# EAGLE design j0y-modul (EAGLE 5.10)
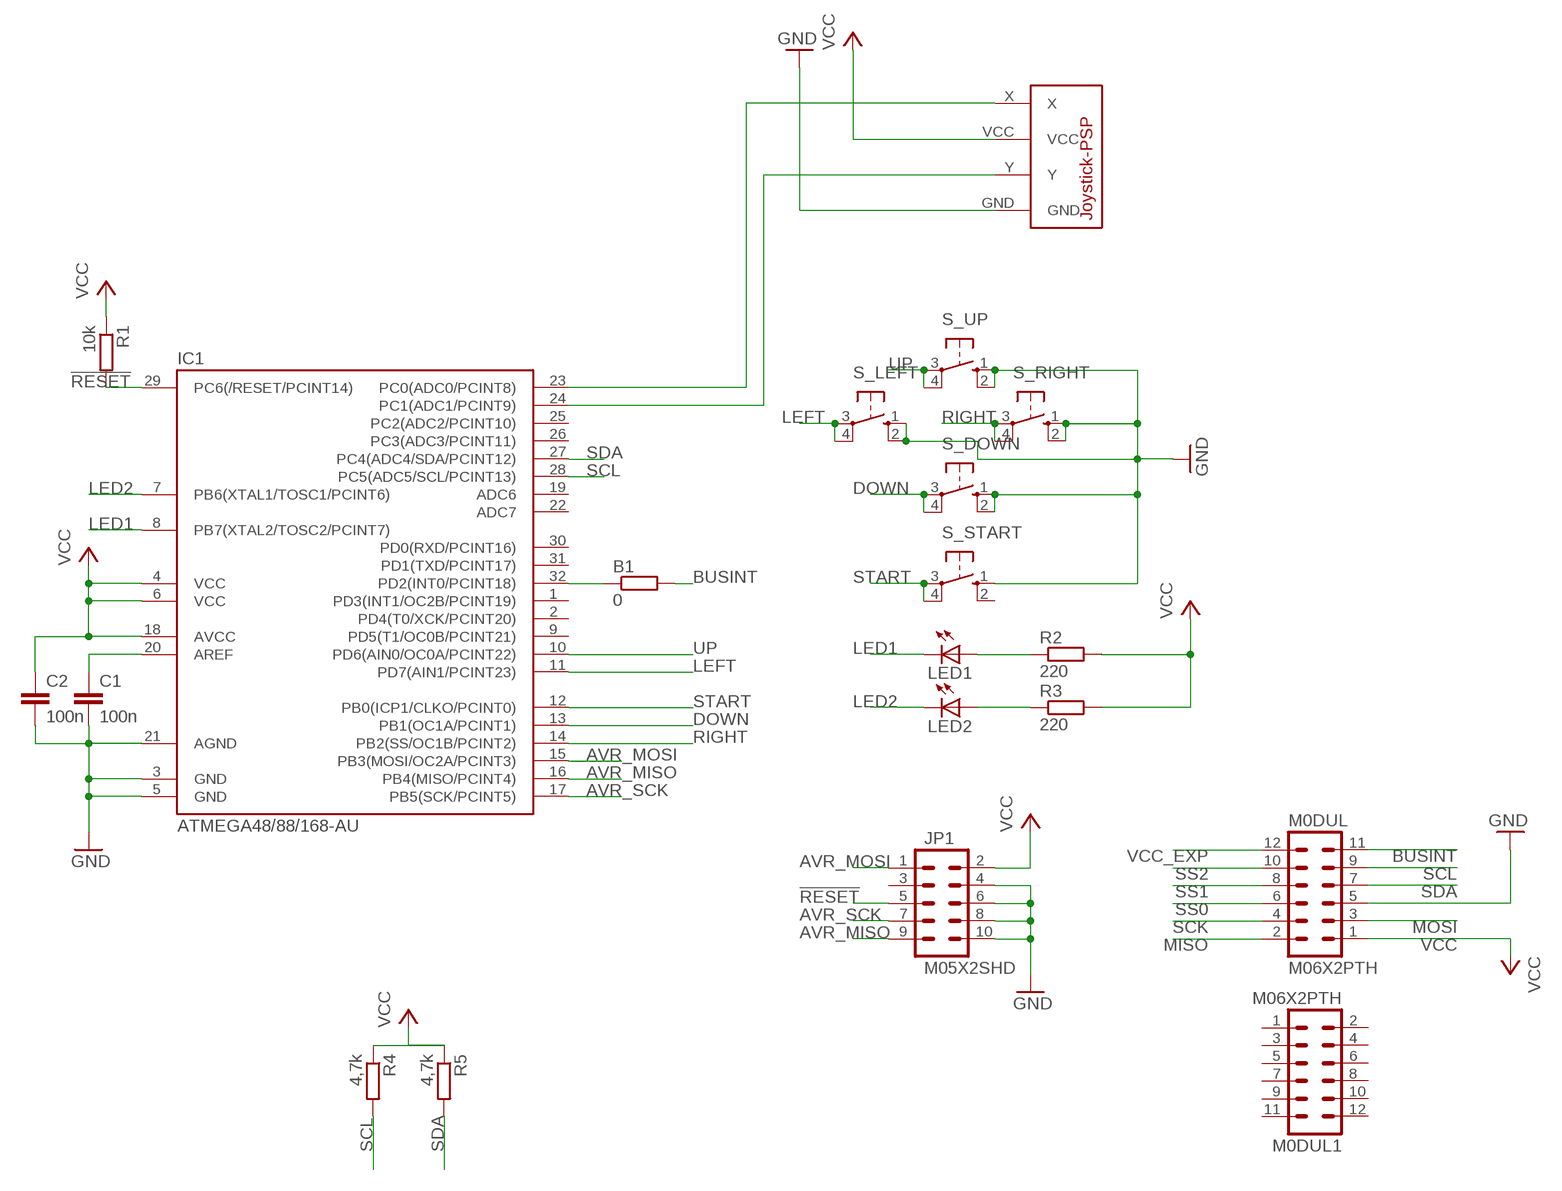
[diagram p0: schematic, sheet 1]

## Parts
B1  0  R-EU_R0805  [R0805]
C1  100n  C-EUC0805  [C0805]
C2  100n  C-EUC0805  [C0805]
IC1  ATMEGA48/88/168-AU  [TQFP32-08]
JP1  M05X2SHD  [2X5-SHROUDED]
LED1  LED3MM  [LED3MM]
LED2  LED3MM  [LED3MM]
M0DUL  M06X2PTH  MA06-2  [MA06-2]
M0DUL1  M06X2PTH  MA06-2  [MA06-2]
R1  10k  R-EU_R0805  [R0805]
R2  220  R-EU_R0805  [R0805]
R3  220  R-EU_R0805  [R0805]
R4  4,7k  R-EU_R0805  [R0805]
R5  4,7k  R-EU_R0805  [R0805]
S_DOWN  10-XX  [B3F-10XX]
S_LEFT  10-XX  [B3F-10XX]
S_RIGHT  10-XX  [B3F-10XX]
S_START  10-XX  [B3F-10XX]
S_UP  10-XX  [B3F-10XX]
U$1  JOYSTICK-PSP1000  [JOYSTICK-PSP1000]

## Nets
!RESET: IC1.29(PC6(/RESET/PCINT14)) JP1.5 R1.2
AVR_MISO: IC1.16(PB4(MISO/PCINT4)) JP1.9
AVR_MOSI: IC1.15(PB3(MOSI/OC2A/PCINT3)) JP1.1
AVR_SCK: IC1.17(PB5(SCK/PCINT5)) JP1.7
BUSINT: B1.2 M0DUL.11
DOWN: IC1.13(PB1(OC1A/PCINT1)) S_DOWN.3(P) S_DOWN.4(P1)
GND: C1.2 C2.2 IC1.3(GND) IC1.5(GND) IC1.21(AGND) JP1.4 JP1.6 JP1.8 JP1.10 M0DUL.5 S_DOWN.1(S) S_DOWN.2(S1) S_LEFT.1(S) S_LEFT.2(S1) S_RIGHT.1(S) S_RIGHT.2(S1) S_START.1(S) S_UP.1(S) S_UP.2(S1) U$1.GND
LED1: IC1.8(PB7(XTAL2/TOSC2/PCINT7)) LED1.K(C)
LED2: IC1.7(PB6(XTAL1/TOSC1/PCINT6)) LED2.K(C)
LEFT: IC1.11(PD7(AIN1/PCINT23)) S_LEFT.3(P) S_LEFT.4(P1)
MISO: M0DUL.2
MOSI: M0DUL.3
N$1: IC1.24(PC1(ADC1/PCINT9)) U$1.Y
N$2: IC1.23(PC0(ADC0/PCINT8)) U$1.X
N$3: C1.1 IC1.20(AREF)
N$4: B1.1 IC1.32(PD2(INT0/PCINT18))
N$6: LED2.A R3.1
N$7: LED1.A R2.1
RIGHT: IC1.14(PB2(SS/OC1B/PCINT2)) S_RIGHT.3(P) S_RIGHT.4(P1)
SCK: M0DUL.4
SCL: IC1.28(PC5(ADC5/SCL/PCINT13)) M0DUL.9 R4.2
SDA: IC1.27(PC4(ADC4/SDA/PCINT12)) M0DUL.7 R5.2
SS0: M0DUL.6
SS1: M0DUL.8
SS2: M0DUL.10
START: IC1.12(PB0(ICP1/CLKO/PCINT0)) S_START.3(P) S_START.4(P1)
UP: IC1.10(PD6(AIN0/OC0A/PCINT22)) S_UP.3(P) S_UP.4(P1)
VCC: C2.1 IC1.4(VCC) IC1.6(VCC) IC1.18(AVCC) JP1.2 M0DUL.1 R1.1 R2.2 R3.2 R4.1 R5.1 U$1.VCC
VCC_EXP [FAT]: M0DUL.12
Unconnected: IC1.1(PD3(INT1/OC2B/PCINT19)) IC1.2(PD4(T0/XCK/PCINT20)) IC1.9(PD5(T1/OC0B/PCINT21)) IC1.19(ADC6) IC1.22(ADC7) IC1.25(PC2(ADC2/PCINT10)) IC1.26(PC3(ADC3/PCINT11)) IC1.30(PD0(RXD/PCINT16)) IC1.31(PD1(TXD/PCINT17)) JP1.3 M0DUL1.1 M0DUL1.2 M0DUL1.3 M0DUL1.4 M0DUL1.5 M0DUL1.6 M0DUL1.7 M0DUL1.8 M0DUL1.9 M0DUL1.10 M0DUL1.11 M0DUL1.12 S_START.2(S1)

## Library data of the parts
B1 R1-R5 = rcl:R-EU_: RESISTOR, European symbol
C1 C2 = rcl:C-EU: CAPACITOR, European symbol
IC1 = atmega8:ATMEGA48/88/168
JP1 = SparkFun:M05X2: Header 5x2 Standard 10-pin dual row 0.1" header. Commonly used with AVR-ISP. Use with Spark Fun Electronics SKU: PRT-00778
LED1 LED2 = adafruit:LED: LED OSRAM: - CHIPLED LG R971, LG N971, LY N971, LG Q971, LY Q971, LO R971, LY R971 LH N974, LH R974 LS Q976, LO Q976, LY Q976 LO Q996 - Hyper CHIPLED LW Q18S LB Q993, LB Q99A, LB R99A - SideLED LS A670, LO A670, LY A670, LG A670, LP A670 LB A673, LV A673, LT A673, LW A673 LH A674 LY A675 LS A676, LA A676, LO A676, LY A676, LW A676 LS A679, LY A679, LG A679 - Hyper Micro SIDELED® LS Y876, LA Y876, LO Y876, LY Y876 LT Y87S - SmartLED LW L88C, LW L88S LB L89C, LB L89S, LG L890 LS L89K, LO L89K, LY L89K LS L896, LA L896, LO L896, LY L896 - TOPLED LS T670, LO T670, LY T670, LG T670, LP T670 LSG T670, LSP T670, LSY T670, LOP T670, LYG T670 LG T671, LOG T671, LSG T671 LB T673, LV T673, LT T673, LW T673 LH T674 LS T676, LA T676, LO T676, LY T676, LB T676, LH T676, LSB T676, LW T676 LB T67C, LV T67C, LT T67C, LS T67K, LO T67K, LY T67K, LW E67C LS E67B, LA E67B, LO E67B, LY E67B, LB E67C, LV E67C, LT E67C LW T67C LS T679, LY T679, LG T679 LS T770, LO T770, LY T770, LG T770, LP T770 LB T773, LV T773, LT T773, LW T773 LH T774 LS E675, LA E675, LY E675, LS T675 LS T776, LA T776, LO T776, LY T776, LB T776 LHGB T686 LT T68C, LB T68C - Hyper Mini TOPLED® LB M676 - Mini TOPLED Santana® LG M470 LS M47K, LO M47K, LY M47K Source: http://www.osram.convergy.de/
M0DUL M0DUL1 = con-lstb:MA06-2: PIN HEADER; OC_FARNELL: unknown; OC_NEWARK: unknown
S_DOWN S_LEFT S_RIGHT S_START S_UP = switch-omron:10-XX: OMRON SWITCH
U$1 = SparkFun:JOYSTICK-PSP1000: This is a footprint for the PSP-1000 Joystick. 4-pins: X, Y, Vcc and GND

## Net classes
1 FAT: width 0.2 mm, drill 0.4 mm
2 GND/3V3: width 0.2 mm, drill 0.4 mm

## Board
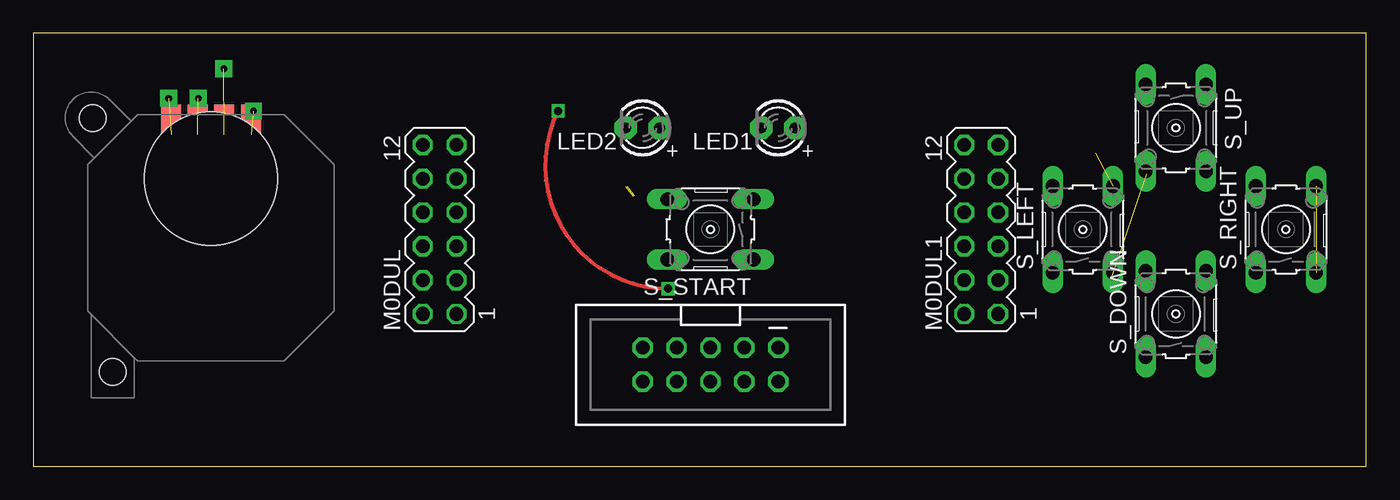
[diagram p1: board, top side]
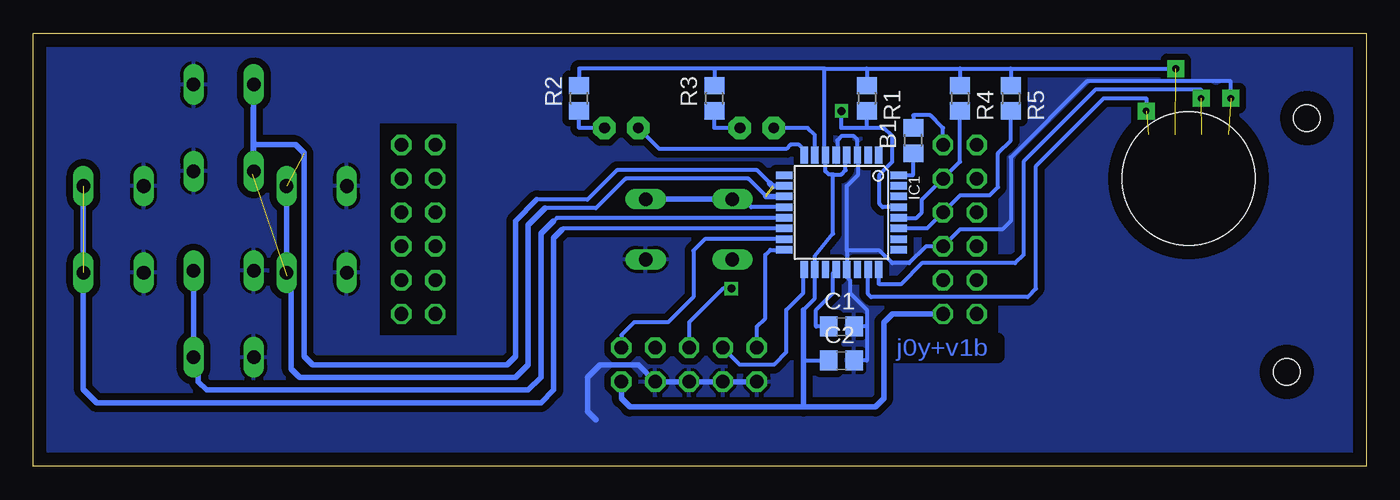
[diagram p2: board, bottom side, seen from below]

Size 100 x 32.5 mm. Coordinates in mm from the lower left corner, seen from the top.
Outline: 0,0 100,0 100,32.5 0,32.5 0,0
Copper layers (1*16): Top 0.035mm / dielectric 1.5mm / Bottom 0.035mm
Design rules "default *": minimum track width 10mil, minimum drill 24mil, track to track 20mil, track to pad 20mil, pad to pad 8mil, via to via 8mil, smd to smd 12mil, copper to edge 40mil, drill to drill 8mil, minimum pad ring 10mil, minimum via ring 8mil, stop-mask expansion 4mil, vias tented up to drill 0mil, thermal gap 10mil
Holes 10 mm at 13.34,21.59
bRestrict: area 68.3,9.8 to 74,25.7; area 27.6,9.8 to 33.3,25.7

### Footprints (pad centres in the part's own frame; a part is rotated, then mirrored left to right if it is on the bottom)
R0805 = smd 1.3 x 1.5: 1 -0.95,0; 2 0.95,0
C0805 = smd 1.3 x 1.5: 1 -0.95,0; 2 0.95,0
TQFP32-08 = smd 1.27 x 0.559: 1 -4.293,2.8; 2 -4.293,2; 3 -4.293,1.2; 4 -4.293,0.4; 5 -4.293,-0.4; 6 -4.293,-1.2; 7 -4.293,-2; 8 -4.293,-2.8; 17 4.293,-2.8; 18 4.293,-2; 19 4.293,-1.2; 20 4.293,-0.4; 21 4.293,0.4; 22 4.293,1.2; 23 4.293,2; 24 4.293,2.8 | smd 0.559 x 1.27: 9 -2.8,-4.293; 10 -2,-4.293; 11 -1.2,-4.293; 12 -0.4,-4.293; 13 0.4,-4.293; 14 1.2,-4.293; 15 2,-4.293; 16 2.8,-4.293; 25 2.8,4.293; 26 2,4.293; 27 1.2,4.293; 28 0.4,4.293; 29 -0.4,4.293; 30 -1.2,4.293; 31 -2,4.293; 32 -2.8,4.293
2X5-SHROUDED = drill 1.016 octagon: 1 -1.27,5.08; 2 1.27,5.08; 3 -1.27,2.54; 4 1.27,2.54; 5 -1.27,0; 6 1.27,0; 7 -1.27,-2.54; 8 1.27,-2.54; 9 -1.27,-5.08; 10 1.27,-5.08
LED3MM = drill 0.813 pad 1.676 octagon: A -1.27,0; K 1.27,0
MA06-2 = drill 1.016 octagon: 1 -6.35,-1.27; 2 -6.35,1.27; 3 -3.81,-1.27; 4 -3.81,1.27; 5 -1.27,-1.27; 6 -1.27,1.27; 7 1.27,-1.27; 8 1.27,1.27; 9 3.81,-1.27; 10 3.81,1.27; 11 6.35,-1.27; 12 6.35,1.27
B3F-10XX = drill 1.016 long: 1 -3.251,2.261; 2 3.251,2.261; 3 -3.251,-2.261; 4 3.251,-2.261
JOYSTICK-PSP1000 = smd 1.5 x 4.5: GND -3,7.75; VCC 1,7.75; X 3,7.75; Y -1,7.75 | hole 2: -8.89,8.985; -7.375,-10.06

### Placement (x,y rotation side)
B1  33.97,24.45 90 bottom
C1  39.37,10.48 0 bottom
C2  39.37,7.94 0 bottom
IC1  39.37,19.05 270 bottom
JP1  50.8,7.62 270 top
LED1  55.88,25.4 180 top
LED2  45.72,25.4 180 top
M0DUL  30.48,17.78 90 top
M0DUL1  71.12,17.78 90 top
R1  37.47,27.62 270 bottom
R2  59.05,27.62 90 bottom
R3  48.9,27.62 90 bottom
R4  30.48,27.62 270 bottom
R5  26.67,27.62 270 bottom
S_DOWN  85.72,11.43 90 top
S_LEFT  78.74,17.78 90 top
S_RIGHT  93.98,17.78 90 top
S_START  50.8,17.78 180 top
S_UP  85.72,25.4 270 top
U$1  13.34,17.14 0 top

### Tracks (layer width: path | path; a pad name or v marks a point on that pad's centre or on a via)
!RESET  (via drill 0.6)
  Top 0.305: v39.37,26.67 arc116 v47.62,13.34
  Bottom 0.305: JP1.5 50.8,10.79 48.26,13.34 v47.62,13.34 | IC1.29 36.28,19.45 36.51,19.68 36.51,21.91 35.56,22.86 35.56,24.77 36.2,25.4 37.47,25.4 | 37.47,25.4 R1.2 | v39.37,26.67 39.37,25.4 37.47,25.4
AVR_MISO
  Bottom 0.305: IC1.16 44.71,16.25 45.09,15.88 45.09,11.11 45.72,10.48 JP1.9
AVR_MOSI
  Bottom 0.305: IC1.15 49.62,17.05 50.48,16.19 50.48,12.7 52.39,10.79 54.93,10.79 55.88,9.84 JP1.1
AVR_SCK
  Bottom 0.305: JP1.7 46.99,7.62 44.45,7.62 43.5,8.57 43.5,11.75 42.23,13.02 42.23,14.7 IC1.17
BUSINT
  Bottom 0.305: B1.2 33.97,26.35 32.7,26.35 31.75,25.4 M0DUL.11
DOWN
  Bottom 0.305: IC1.13 60.73,18.65 60.96,18.41
  Bottom 0.406: S_DOWN.3 S_DOWN.4 87.99,7.34 87.63,6.99 87.63,6.35 87,5.71 62.87,5.71 61.91,6.67 61.91,17.46 60.96,18.41
GND  (1 unrouted)
  Bottom 0.305: 37.47,10.48 C1.2 | 37.47,10.48 37.47,11.75 38.73,13.02 38.73,13.97 39.05,14.29 39.05,14.68 IC1.21 38.97,16.19 | C2.2 37.47,7.94 37.47,10.48 | 38.97,16.19 38.97,21.04 38.1,21.91 38.1,23.27 IC1.3 38.17,24.52 38.42,24.77 39.37,24.77 39.69,24.45 39.69,23.43 IC1.5 | 38.97,16.19 36.51,16.19 35.56,15.24 34.29,15.24 33.02,16.51 M0DUL.5 30.48,17.78 27.3,17.78 26.67,18.41 26.67,23.18 20.95,28.89 10.16,28.89 10.16,27.62
  Bottom 0.406: JP1.10 JP1.8 JP1.6 JP1.4 54.61,7.62 57.47,7.62 58.42,6.67 58.42,4.13 57.78,3.49
  pour Bottom: -1.27,-1.27 -1.27,35.56 101.6,35.56 101.6,-1.27
LED1
  Bottom 0.305: IC1.8 42.17,23.75 42.55,24.13 43.18,24.13 43.5,23.81 53.02,23.81 LED1.K
LED2
  Bottom 0.305: IC1.7 41.37,24.86 41.91,25.4 LED2.K
LEFT  (2 unrouted)
  Bottom 0.305: 44.45,20.95 45.72,22.23 56.2,22.23 58.42,20 62.23,20
  Bottom 0.406: S_LEFT.3 S_LEFT.4 | 62.23,20 63.82,18.41 63.82,8.26 64.45,7.62 79.06,7.62 79.69,8.26 79.69,23.5 80.33,24.13 83.5,24.13 | IC1.11 45.02,20.25 45.09,20.32
N$1  (via drill 0.5 pad 1.27)  (1 unrouted)
  Bottom 0.305: IC1.24 36.57,13.71 36.51,13.65 34.92,13.65 33.34,15.24 26.35,15.24 25.72,15.88 25.72,22.86 20.32,28.26 12.38,28.26 v12.38,27.62
N$2  (1 unrouted)
  Bottom 0.305: IC1.23 37.37,12.92 37.15,12.7 25.4,12.7 24.77,13.34 24.77,22.54 19.68,27.62 16.51,27.62 16.51,26.67
N$3
  Bottom 0.305: C1.1 41.27,10.48 41.27,11.75 40.01,13.02 40.01,14.52 IC1.20
N$4
  Bottom 0.305: IC1.32 34.03,21.85 33.97,21.91 B1.1
N$5  (via drill 0.5 pad 1.27)
  other vias: 14.29,29.84
N$6
  Bottom 0.305: R3.1 48.9,25.4 LED2.A
N$7
  Bottom 0.305: R2.1 59.05,25.4 LED1.A
N$8  (via drill 0.5 pad 1.27)
  other vias: 16.51,26.67
N$9  (via drill 0.5 pad 1.27)
  other vias: 10.16,27.62
RIGHT  (1 unrouted)
  Bottom 0.305: IC1.14 60.26,17.85 60.33,17.78
  Bottom 0.406: S_RIGHT.4 96.24,5.75 95.25,4.76 61.91,4.76 60.96,5.71 60.96,17.14 60.33,17.78
SCL
  Bottom 0.305: IC1.28 33.74,18.65 33.34,19.05 33.34,20 M0DUL.9 30.48,22.86 R4.2
SDA
  Bottom 0.305: IC1.27 32.95,17.85 M0DUL.7 30.48,20.32 28.26,20.32 27.62,20.95 27.62,23.5 26.67,24.45 R5.2
START
  Bottom 0.305: IC1.12 46.12,19.45 46.35,19.68 47.19,19.68 S_START.4
  Bottom 0.406: S_START.4 S_START.3
UP  (2 unrouted)
  Bottom 0.305: 61.59,19.37 57.78,19.37 55.56,21.59 46.35,21.59 45.09,20.32
  Bottom 0.406: S_UP.4 S_UP.3 83.54,21.95 | 61.59,19.37 62.87,18.1 62.87,7.62 63.82,6.67 80.01,6.67 80.64,7.3 80.64,13.97 80.96,14.29 | IC1.10 44.55,21.05 44.77,21.27
VCC  (1 unrouted)
  Bottom 0.305: 42.23,11.75 41.37,12.61 IC1.18 41.37,15.78 40.01,17.46 40.01,21.91 | 42.23,7.94 C2.1 | 40.01,21.91 40.32,21.91 40.57,22.16 IC1.6 40.64,23.41 40.64,29.84 | 40.01,21.91 39.37,21.91 39.05,22.23 39.05,23.26 IC1.4 | 40.64,29.84 48.9,29.84 | 48.9,29.84 R3.2 | 37.47,29.84 R1.1 | 40.64,29.84 37.47,29.84 | 37.47,29.84 30.48,29.84 | 30.48,29.84 R4.1 | 30.48,29.84 26.67,29.84 | 26.67,29.84 R5.1 | 26.67,29.84 14.29,29.84 | R2.2 59.05,29.84 48.9,29.84
  Bottom 0.406: JP1.2 55.88,5.08 55.24,4.45 42.23,4.45 | 42.23,4.45 42.23,7.94 42.23,11.75 | M0DUL.1 35.56,11.43 36.2,10.79 36.2,5.08 36.83,4.45 42.23,4.45

### Text on the board
Bottom: j0y+v1b